# EasyEDA Pro project EasyEDAproject_AngstromIO_Mini_Devboard_2026-03-15.epro, board Dual CH340 Programmer only
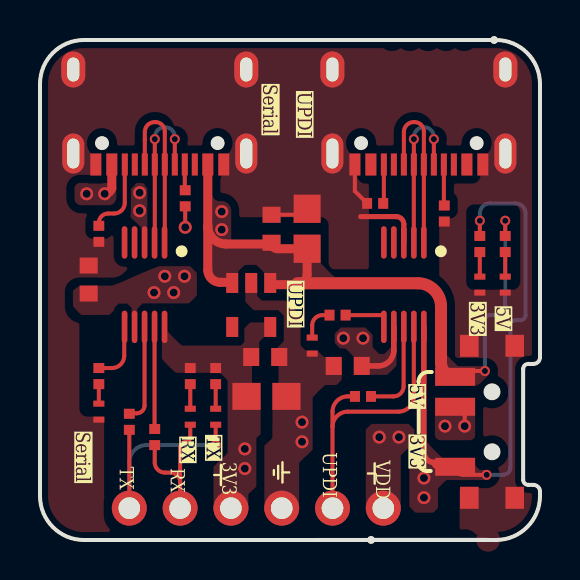
[diagram p3: board, top side]
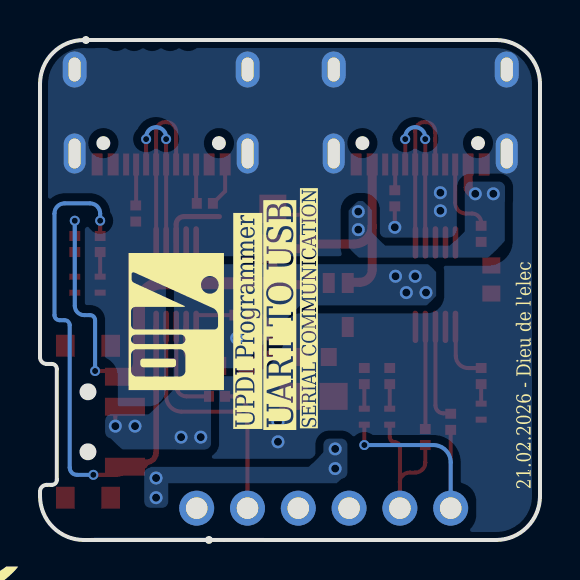
[diagram p4: board, bottom side, seen from below]

Outline 25 x 25 mm; copper layers: Top Layer, Bottom Layer. Coordinates in mm from the lower left corner of the outline.
Outline path: 22.37,25 2.2,25 arc(0.64,24.36) 0,22.8 0,2.2 arc(0.64,0.64) 2.2,0 15.8,0 22.41,0 22.8,0 arc(24.36,0.64) 25,2.2 25,2.42 arc(24.9,2.66) 24.67,2.76 24.41,2.76 arc(24.23,2.83) 24.16,3.01 24.16,8.55 arc(24.23,8.73) 24.41,8.8 24.67,8.8 arc(24.9,8.9) 25,9.14 25,14.04 25,20.7 25,22.8 arc(24.36,24.36) 22.8,25 ; 22.3,0 16.55,0 ; 22.71,25 22.71,25 22.8,25 ; 22.24,25 22.75,25 22.8,25
Stack: Top Layer 0.035mm / Dielectric1 1.51mm FR4 er 4.5 / Bottom Layer 0.035mm

## Design rules (mm)
template: Custom Config
spacing copperThickness1oz (default): track to track 0.102, other pairs 0.152 to 0.3
spacing copperThickness2oz: track to track 0.203, other pairs 0.152 to 0.3
track width copperThickness1oz (default): min 0.127, default 0.254, max 2.54
track width copperThickness2oz: min 0.203, default 0.254, max 2.54
differential pair differentialPair (default): width min 0.127, default 0.254, max 2.54; gap min 0.152, default 0.152
via viaSize (default): diameter min 0.5, default 0.61, max 10; hole min 0.3, default 0.305, max 6.3
net GND uses PGM gnd

## Placement (name value [footprint] x y rotation side)
C8  100nF  [0603 CAP clean]  11.26 9.15 180 top
C9  100nF  [0603 CAP clean]  11.58 15.56 270 top
C10  10uF  [C0805]  13.36 15.56 90 top
C11  10uF  [C0805]  11.32 7.18 0 top
C12  100nF  [0603 CAP clean]  15.39 8.7 0 top
C13  100nF  [0603 CAP clean]  2.43 13.02 270 top
LED24  XL-1005SURC  [LED0402]  23.26 12.77 90 top
LED25  XL-1005SURC  [LED0402]  21.99 12.77 90 top
LED26  XL-1005SURC  [LED0402]  13.61 9.72 90 top
LED28  XL-1005SURC  [LED0402]  2.94 6.42 90 top
LED29  XL-1005SURC  [LED0402]  7.51 6.16 90 top
LED30  XL-1005SURC  [LED0402]  8.78 6.16 90 top
NOREF  -  [Pad_e3378]  9.55 1.59 270 top
NOREF#2  -  [Pad_e3379]  12.09 1.59 270 top
NOREF#3  -  [Pad_e3381]  17.17 1.59 270 top
NOREF#4  -  [Pad_e3376]  4.47 1.59 270 top
NOREF#5  -  [Pad_e3377]  7.01 1.59 270 top
NOREF#6  -  [Pad_e3380]  14.63 1.59 270 top
R13  5.1K  [thinner 0402]  20.21 16.32 90 top
R14  5.1K  [thinner 0402]  16.76 16.83 0 top
R15  5.1K  [thinner 0402]  7.26 17.09 90 top
R16  5.1K  [thinner 0402]  2.94 15.31 90 top
R17  5.1K  [thinner 0402]  23.26 14.8 90 top
R18  1K  [thinner 0402]  21.99 14.8 90 top
R19  1K  [thinner 0402]  14.88 11.24 0 top
R20  1K  [thinner 0402]  16.15 7.18 0 top
R22  1K  [thinner 0402]  2.94 8.2 90 top
R23  1K  [thinner 0402]  4.47 5.91 90 top
R24  1K  [thinner 0402]  5.74 5.15 90 top
R25  5.1K  [thinner 0402]  7.51 8.2 90 top
R26  5.1K  [thinner 0402]  8.78 8.2 90 top
SW3  MK-12C02-G015  [SW-SMD_G-SWITCH_MK-12C02-G015]  22.25 5.91 90 top
U4  CH340E  [MSOP-10_L3.0-W3.0-P0.50-LS5.0-BL]  18.19 12.77 180 top
U6  TLV75733PDBVR  [SOT-23-5_L2.9-W1.6-P0.95-LS2.8-BL]  10.56 11.75 180 top
U7  CH340E  [MSOP-10_L3.0-W3.0-P0.50-LS5.0-BL]  5.23 12.77 180 top
USB2  TYPE-C 16PIN 2MD(073)  [USB-C-SMD_TYPE-C-6PIN-2MD-073]  18.94 21.15 180 top
USB3  TYPE-C 16PIN 2MD(073)  [USB-C-SMD_TYPE-C-6PIN-2MD-073]  5.99 21.15 180 top

## Footprints (pads in the part's own frame, mm; a bottom-side part is the same pattern mirrored in y, then rotated)
0603 CAP clean
  rect 0.8x0.9 smd: 1(-0.7,0) 2(0.7,0)
C0805
  rect 1.41x1.35 smd: 1(-1,0) 2(1,0)
LED0402
  rect 0.3x0.55 smd: 1(-0.4,0) 2(0.4,0)
MSOP-10_L3.0-W3.0-P0.50-LS5.0-BL
  oval 0.28x1.62 smd: 1(-1,-2.11) 2(-0.5,-2.11) 3(0,-2.11) 4(0.5,-2.11) 5(1,-2.11) 6(1,2.11) 7(0.5,2.11) 8(0,2.11) 9(-0.5,2.11) 10(-1,2.11)
Pad_e3376
  rrect 1.75x1.75 hole 1.08: 4(0,0)
Pad_e3377
  rrect 1.75x1.75 hole 1.08: 5(0,0)
Pad_e3378
  rrect 1.75x1.75 hole 1.08: 5(0,0)
Pad_e3379
  rrect 1.75x1.75 hole 1.08: 3(0,0)
Pad_e3380
  rrect 1.75x1.75 hole 1.08: 2(0,0)
Pad_e3381
  rrect 1.75x1.75 hole 1.08: 2(0,0)
SOT-23-5_L2.9-W1.6-P0.95-LS2.8-BL
  rect 0.6x1 smd: 1(-0.95,-1.1) 2(0,-1.1) 3(0.95,-1.1) 4(0.95,1.1) 5(-0.95,1.1)
SW-SMD_G-SWITCH_MK-12C02-G015
  rect 0.9x2 smd: 1(-2.25,1.49) 2(0.75,1.49) 3(2.25,1.49)
  rect 1.1x0.93 smd: 4(3.8,0.779) 5(3.8,-1.49) 6(-3.8,-1.49) 7(-3.8,0.779)
thinner 0402
  rect 0.5x0.54 smd: 1(-0.403,0) 2(0.402,0)
USB-C-SMD_TYPE-C-6PIN-2MD-073
  rect 0.55x1.1 smd: 1(-3.2,2.375) 2(-2.4,2.375) 11(2.4,2.375) 12(3.2,2.375)
  rect 0.3x1.1 smd: 3(-1.75,2.375) 4(-1.25,2.375) 5(-0.75,2.375) 6(-0.25,2.375) 7(0.25,2.375) 8(0.75,2.375) 9(1.25,2.375) 10(1.75,2.375)
  oval 1.1x2 hole 0.6x1.5: 13(-4.325,1.825) 14(4.325,1.825)
  oval 1.2x1.8 hole 0.6x1.2: 13(-4.325,-2.375) 14(4.325,-2.375)

## Nets
+3.3V: C8.2 C11.1 NOREF.5 R18.2 R25.2 R26.2 SW3.1 U4.10 U6.5 U7.10
GND: C8.1 C9.1 C10.2 C11.2 C12.1 C13.1 LED24.1 LED25.1 LED26.1 LED28.1 NOREF#2.3 R13.1 R14.1 R15.1 R16.1 SW3.4 SW3.5 SW3.6 SW3.7 U4.3 U6.2 U7.3 USB2.1 USB2.12 USB2.13 USB2.14 USB3.1 USB3.12 USB3.13 USB3.14
VBUS: C9.2 C10.1 R17.2 SW3.3 U6.1 U6.3 USB3.2 USB3.11
VDD.P: C12.2 C13.2 NOREF#3.2 SW3.2 U4.7 U7.7
D+.PGM: U4.1 USB2.6 USB2.8
D+.SERIAL: U7.1 USB3.6 USB3.8
D-.PGM: U4.2 USB2.5 USB2.7
D-.SERIAL: U7.2 USB3.5 USB3.7
RX: LED29.1 NOREF#5.5 R24.1
TX: LED30.1 NOREF#4.4 R23.1
UPDI: NOREF#6.2 R20.1 U4.9
$1N16182: R13.2 USB2.4
$1N16183: R14.2 USB2.10
$1N17922: R16.2 USB3.10
$1N17923: R15.2 USB3.4
$1N18529: LED24.2 R17.1
$1N18636: LED25.2 R18.1
$1N18732: R19.2 U4.6
$1N18734: LED26.2 R19.1
$1N19203: R20.2 U4.8
$1N21642: LED28.2 R22.1
$1N21643: R22.2 U7.6
$1N21653: R23.2 U7.8
$1N21686: R24.2 U7.9
$1N21796: LED29.2 R25.1
$1N21889: LED30.2 R26.1

Pads without a net: U4 4 5; U6 4; U7 4 5; USB2 2 3 9 11; USB3 3 9

## Via types
v1: diameter 0.65, hole 0.4, Top Layer to Bottom Layer, 23 vias
v2: diameter 0.5, hole 0.305, Top Layer to Bottom Layer, 9 vias

## Routing (per net, layer and track width the routed paths; a pad name or vN(x,y) marks a point on that pad's centre or on a via; arc(x,y) is an arc through that point)
+3.3V: length 28.7
  Top Layer w0.2: v2(22.33,3.26) 21.16,3.26 arc(20.87,3.38) 20.76,3.66 ; R18.2 v2(21.99,15.96)
  Top Layer w0.28: U4.10 19.19,4.39 arc(19.34,4.03) 19.71,3.88 arc(19.77,3.72) 19.92,3.66 20.76,3.66
  Bottom Layer w0.2: v2(21.99,15.96) 21.99,16.32 arc(22.14,16.68) 22.5,16.83 23.77,16.83 arc(24.13,16.68) 24.28,16.32 24.28,11.24 arc(24.2,11.06) 24.02,10.99 23.77,10.99 arc(23.59,10.92) 23.52,10.74 23.52,3.62 arc(23.41,3.37) 23.15,3.26 v2(22.33,3.26)
  vias: v1(10.24,4.55) v1(10.24,3.57) v1(19.2,3.1) v1(19.2,2.12)
GND: length 8.4
  Top Layer w0.2: v1(7.26,15.64) 7.26,16.68 ; R14.1 15.74,17.44 USB2.12 ; C10.2 13.06,16.26 C9.1
  Top Layer w0.254: U4.3 18.19,15.79 arc(18.08,16.06) 17.81,16.17 16.03,16.17
  vias: v1(4.98,17.36) v1(4.98,16.46) v1(13.1,5.89) v1(13.1,4.91)
VBUS: length 40
  Top Layer w0.2: v2(22.25,8.45) 21.05,8.45 20.76,8.16 ; R17.2 v2(23.26,15.96)
  Top Layer w0.45: USB3.11 3.59,17.59 arc(3.46,17.39) v1(3.24,17.31) ; 8.39,15.7 USB3.2 ; 8.39,15.7 8.39,13.51 arc(8.57,13.07) 9.01,12.88 9.58,12.88 arc(9.6,12.87) U6.3 ; 8.39,15.7 arc(8.65,15.06) 9.29,14.8 11.52,14.8 arc(11.56,14.82) C9.2 arc(11.67,14.65) 11.88,14.56 C10.1 13.36,13.28 arc(13.29,13.03) 13.12,12.85 arc(13.11,12.84) 13.11,12.84 arc(13.1,12.83) 13.09,12.83 arc(13.08,12.82) 13.07,12.82 arc(13.04,12.81) 13.02,12.8 arc(12.94,12.78) 12.85,12.77 11.6,12.77 arc(11.54,12.79) U6.1
  Top Layer w0.6: 12.87,12.84 18.89,12.84 arc(19.71,12.5) 20.05,11.68 20.05,8.86 arc(20.26,8.37) 20.76,8.16
  Bottom Layer w0.2: v2(22.25,8.45) 22.25,10.99 arc(22.32,11.17) 22.5,11.24 22.8,11.24 arc(23.13,11.38) 23.26,11.71 v2(23.26,15.96)
  vias: v1(2.33,17.31) v1(9.09,16.42) v1(9.09,15.52)
VDD.P: length 4.5
  Top Layer w0.2: v1(21.23,5.69) 21.23,6.18 arc(21.09,6.52) 20.76,6.66
  Top Layer w0.28: U4.7 17.69,9.48 arc(17.46,8.93) 16.91,8.7 C12.2
  vias: v1(5.7,12.37) v1(6.24,13.19) v1(6.69,12.37) v1(7.22,13.19) v1(15.17,10.09) v1(16.15,10.09) v1(16.96,5.14) v1(17.95,5.14) v1(20.25,5.69)
D+.PGM: length 8.7
  Top Layer w0.2: USB2.8 18.19,20 arc(18.19,20.04) 18.19,20.09 18.19,20.4 arc(18.34,20.75) 18.69,20.9 18.73,20.9 arc(19.06,20.76) 19.19,20.43 USB2.6 19.19,14.88 arc(19.19,14.88) U4.1
D+.SERIAL: length 8.7
  Top Layer w0.2: USB3.8 5.24,20 arc(5.24,20.04) 5.24,20.09 5.24,20.4 arc(5.39,20.75) 5.74,20.9 5.77,20.9 arc(6.1,20.76) 6.24,20.43 USB3.6 6.24,14.89 arc(6.24,14.88) U7.1
D-.PGM: length 8.2
  Top Layer w0.2: v2(19.69,20.04) USB2.5 ; v2(18.69,20.04) USB2.7 arc(18.69,18.77) 18.69,18.77 U4.2
  Bottom Layer w0.2: v2(18.69,20.04) 18.69,20.14 arc(18.84,20.49) 19.2,20.64 arc(19.55,20.5) 19.69,20.15 v2(19.69,20.04)
D-.SERIAL: length 8.2
  Top Layer w0.2: v2(5.74,20.04) USB3.7 5.74,14.89 arc(5.74,14.88) U7.2 ; v2(6.74,20.04) USB3.5
  Bottom Layer w0.2: v2(6.74,20.04) 6.74,20.15 arc(6.59,20.5) 6.24,20.64 arc(5.89,20.49) 5.74,20.14 v2(5.74,20.04)
RX: length 7.2
  Top Layer w0.2: 7.01,2.9 7.01,4.64 arc(7.08,4.82) 7.26,4.89 arc(7.44,4.97) 7.51,5.15 LED29.1 ; 7.01,2.9 NOREF#5.5 ; 7.01,2.9 arc(6.87,3.23) 6.53,3.37 6.24,3.37 arc(5.88,3.52) 5.74,3.88 R24.1
TX: length 12
  Top Layer w0.2: R23.1 NOREF#4.4 ; LED30.1 v2(8.78,4.75)
  Bottom Layer w0.2: v2(8.78,4.75) 5.34,4.75 arc(4.72,4.49) 4.47,3.88 NOREF#4.4
UPDI: length 14.8
  Top Layer w0.2: R20.1 15.39,7.18 arc(14.85,6.96) 14.63,6.42 14.63,5.66 ; U4.9 18.69,7.18 arc(18.47,6.64) 17.93,6.42 15.39,6.42 arc(14.85,6.19) 14.63,5.66 ; 14.63,5.66 NOREF#6.2
$1N16182: length 2.1
  Top Layer w0.2: USB2.4 20.19,16.75 arc(20.2,16.73) R13.2
$1N16183: length 2
  Top Layer w0.2: USB2.10 17.19,16.87 arc(17.18,16.84) R14.2
$1N17922: length 3.9
  Top Layer w0.2: R16.2 2.94,15.86 arc(3.08,16.19) 3.41,16.32 3.7,16.32 arc(4.08,16.48) 4.24,16.86 USB3.10
$1N17923: length 1.3
  Top Layer w0.2: USB3.4 7.24,17.51 R15.2
$1N18529: length 1.2
  Top Layer w0.2: R17.1 LED24.2
$1N18636: length 1.2
  Top Layer w0.2: R18.1 LED25.2
$1N18732: length 1.9
  Top Layer w0.2: R19.2 17.16,11.24 17.2,11.2
$1N18734: length 1.8
  Top Layer w0.2: LED26.2 13.61,10.74 arc(13.76,11.1) 14.12,11.24 R19.1
$1N19203: length 4.9
  Top Layer w0.2: R20.2 17.67,7.18 arc(18.03,7.33) 18.18,7.69 18.18,10.65 arc(18.18,10.66) U4.8
$1N21642: length 1
  Top Layer w0.2: LED28.2 R22.1
$1N21643: length 3.1
  Top Layer w0.2: 4.25,11.14 4.26,11.15 ; R22.2 3.6,8.6 arc(4.03,8.78) 4.21,9.21 4.21,10.64 arc(4.22,10.65) U7.6
$1N21653: length 4.9
  Top Layer w0.2: U7.8 5.23,6.73 arc(5.11,6.45) 4.83,6.33 4.49,6.33 arc(4.47,6.33) R23.2
$1N21686: length 5.1
  Top Layer w0.2: U7.9 5.73,5.56 arc(5.73,5.55) R24.2
$1N21796: length 1.2
  Top Layer w0.2: R25.1 LED29.2
$1N21889: length 1.2
  Top Layer w0.2: R26.1 LED30.2

## Copper pours and planes (outline as drawn; the poured copper is in the pictures)
+3.3V on Top Layer: 6.09,10.88 11.31,10.88 11.31,1.28 6.09,1.28
+3.3V on Top Layer: 18.47,5.17 22.57,5.17 22.57,1.37 18.47,1.37
+3.3V on Bottom Layer: 18.59,3.61 19.79,3.61 19.79,1.61 18.59,1.61
+3.3V on Bottom Layer: 9.63,4.4 19.79,4.4 19.79,2.84 9.63,2.84
+3.3V on Bottom Layer: 9.63,5.07 10.83,5.07 10.83,3.07 9.63,3.07
GND on Top Layer: 25.2,24.6 25.2,-0.21 -0.33,-0.21 -0.33,24.6
GND on Top Layer: 4.54,17.84 5.37,17.84 5.37,15.47 4.54,15.47
GND on Top Layer: 10.26,12.47 15.09,12.47 15.09,1.35 10.26,1.35
GND on Top Layer: 5.19,15.34 5.32,15.4 5.37,15.52 5.37,17.58 5.31,17.72 5.16,17.79 4.79,17.79 4.63,17.72 4.56,17.56 4.56,16.24 4.62,16.1 4.75,16.05 4.92,16.05 5.03,16 5.08,15.88 5.08,15.35 5.09,15.34
GND on Bottom Layer: 25.3,24.61 25.3,-0.12 -0.24,-0.12 -0.24,24.61
VBUS on Top Layer: 19.75,9.26 22.49,9.26 22.49,7.71 19.75,7.71
VBUS on Top Layer: 8.4,15.49 15.11,15.49 15.11,12.81 8.4,12.81
VBUS on Top Layer: 3.69,17.76 3.78,17.73 3.82,17.64 3.82,17.11 3.71,16.85 3.44,16.74 2.07,16.74 1.82,16.84 1.72,17.09 1.72,17.57 1.8,17.77 2,17.85 3.55,17.85 3.62,17.83 3.64,17.76
VBUS on Bottom Layer: 1.76,17.38 9.57,17.38 9.57,14.12 1.76,14.12
VBUS on Bottom Layer: 1.75,17.92 3.75,17.92 3.75,16.72 1.75,16.72
VDD.P on Top Layer: 16.29,5.81 18.72,5.81 18.72,1.34 16.29,1.34
VDD.P on Top Layer: 21.34,6.64 21.63,6.52 21.76,6.22 21.76,5.24 21.68,5.07 21.5,4.99 20.02,4.99 19.83,5.07 19.75,5.27 19.75,6.36 19.83,6.56 20.03,6.64
VDD.P on Top Layer: 1.65,13.69 7.84,13.69 7.84,11.04 1.65,11.04
VDD.P on Top Layer: 14.74,10.63 17.83,10.63 17.83,8.26 14.74,8.26
VDD.P on Bottom Layer: 14.66,10.68 21.74,10.68 21.74,4.53 14.66,4.53
VDD.P on Bottom Layer: 5.19,13.79 18.3,13.79 18.3,7.79 5.19,7.79
VDD.P on Bottom Layer: 14.66,10.68 16.66,10.68 16.66,9.48 14.66,9.48
VDD.P on Bottom Layer: 16.45,5.73 18.45,5.73 18.45,4.53 16.45,4.53
VDD.P on Bottom Layer: 19.74,6.28 21.74,6.28 21.74,5.08 19.74,5.08
GND on Top Layer: 5.37,15.51 5.37,17.67 5.3,17.83 5.14,17.9 4.75,17.9 4.6,17.84 4.54,17.69 4.54,16.19 4.6,16.04 4.99,15.88 5.09,15.64 5.09,15.54 5.1,15.52 5.12,15.51
VBUS on Top Layer: 8.72,17.05 8.98,16.94 9.07,16.94 9.42,16.8 9.56,16.45 9.56,15.3 9.64,15.1 9.84,15.02 10.06,15.02 9.96,14.79 9.74,14.7 8.35,14.7 8.35,17.04 8.42,17.23 8.62,17.31

## Text on the board
Bottom Silkscreen Layer: . | 21.02.2026 - Dieu de l'elec | SERIAL COMMUNICATION | UPDI Programmer | UART TO USB
Top Silkscreen Layer: Serial | TX | RX | 3V3 | UPDI | VDD | 5V
